# Altium schematic sheet Motordrivers.SchDoc
size A4; Revision: 0; SheetNumber: 1; SheetTotal: 4
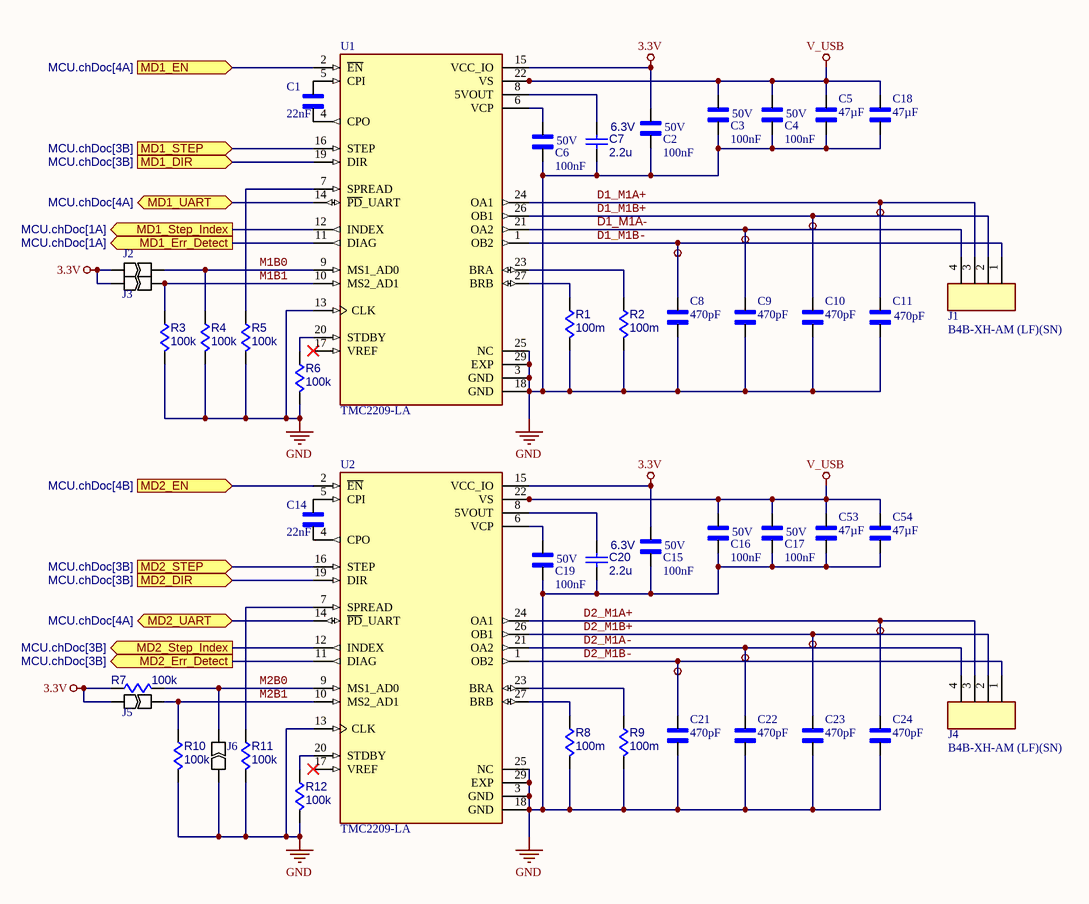
[diagram p0: Motordrivers.SchDoc]

## Parts
C1  value 22nF  [CAPC1005X55N]  (hidden comment: C0402C223K5REC7411)
C2  value 100nF  Voltage Rating: 50V  [CAPC1608X90N]  (hidden comment: GCM188L81H104KA57D)
C3  value 100nF  Voltage Rating: 50V  [CAPC1608X90N]  (hidden comment: GCM188L81H104KA57D)
C4  value 100nF  Voltage Rating: 50V  [CAPC1608X90N]  (hidden comment: GCM188L81H104KA57D)
C5  value 47µF  [CAPC3225X270N]  (hidden comment: GRM32ER61C476KE15L)
C6  value 100nF  Voltage Rating: 50V  [CAPC1608X90N]  (hidden comment: GCM188L81H104KA57D)
C7  value 2.2u  Voltage Rating: 6.3V  [CAPC0603(1608)100_L]  (hidden comment: Capacitors,2.2u,6.3V)
C8  value 470pF  [CAPC1608X90N]  (hidden comment: GRM1885C2A471JA01D)
C9  value 470pF  [CAPC1608X90N]  (hidden comment: GRM1885C2A471JA01D)
C10  value 470pF  [CAPC1608X90N]  (hidden comment: GRM1885C2A471JA01D)
C11  value 470pF  [CAPC1608X90N]  (hidden comment: GRM1885C2A471JA01D)
C14  value 22nF  [CAPC1005X55N]  (hidden comment: C0402C223K5REC7411)
C15  value 100nF  Voltage Rating: 50V  [CAPC1608X90N]  (hidden comment: GCM188L81H104KA57D)
C16  value 100nF  Voltage Rating: 50V  [CAPC1608X90N]  (hidden comment: GCM188L81H104KA57D)
C17  value 100nF  Voltage Rating: 50V  [CAPC1608X90N]  (hidden comment: GCM188L81H104KA57D)
C18  value 47µF  [CAPC3225X270N]  (hidden comment: GRM32ER61C476KE15L)
C19  value 100nF  Voltage Rating: 50V  [CAPC1608X90N]  (hidden comment: GCM188L81H104KA57D)
C20  value 2.2u  Voltage Rating: 6.3V  [CAPC0603(1608)100_L]  (hidden comment: Capacitors,2.2u,6.3V)
C21  value 470pF  [CAPC1608X90N]  (hidden comment: GRM1885C2A471JA01D)
C22  value 470pF  [CAPC1608X90N]  (hidden comment: GRM1885C2A471JA01D)
C23  value 470pF  [CAPC1608X90N]  (hidden comment: GRM1885C2A471JA01D)
C24  value 470pF  [CAPC1608X90N]  (hidden comment: GRM1885C2A471JA01D)
C53  value 47µF  [CAPC3225X270N]  (hidden comment: GRM32ER61C476KE15L)
C54  value 47µF  [CAPC3225X270N]  (hidden comment: GRM32ER61C476KE15L)
J1  B4B-XH-AM (LF)(SN)  [FP-B4B-XH-AM_LF_SN-MFG]
J2  JUMPER  [JUMPER]  (value not drawn)
J3  JUMPER  [JUMPER]  (value not drawn)
J4  B4B-XH-AM (LF)(SN)  [FP-B4B-XH-AM_LF_SN-MFG]
J5  JUMPER  [JUMPER]  (value not drawn)
J6  JUMPER  [JUMPER]  (value not drawn)
R1  value 100m  [RESC0402(1005)_L]  (hidden comment: Resistors,0402,1%,100m)
R2  value 100m  [RESC0402(1005)_L]  (hidden comment: Resistors,0402,1%,100m)
R3  value 100k  [RESC0402(1005)_L]  (hidden comment: Resistors,0402,100k)
R4  value 100k  [RESC0402(1005)_L]  (hidden comment: Resistors,0402,100k)
R5  value 100k  [RESC0402(1005)_L]  (hidden comment: Resistors,0402,100k)
R6  value 100k  [RESC0402(1005)_L]  (hidden comment: Resistors,0402,100k)
R7  value 100k  [RESC0402(1005)_L]  (hidden comment: Resistors,0402,100k)
R8  value 100m  [RESC0402(1005)_L]  (hidden comment: Resistors,0402,1%,100m)
R9  value 100m  [RESC0402(1005)_L]  (hidden comment: Resistors,0402,1%,100m)
R10  value 100k  [RESC0402(1005)_L]  (hidden comment: Resistors,0402,100k)
R11  value 100k  [RESC0402(1005)_L]  (hidden comment: Resistors,0402,100k)
R12  value 100k  [RESC0402(1005)_L]  (hidden comment: Resistors,0402,100k)
U1  TMC2209-LA  [QFN50P500X500X90-29N]
U2  TMC2209-LA  [QFN50P500X500X90-29N]

## Ports
MD1_DIR (in, see MCU.chDoc[3B]), MD1_EN (in, see MCU.chDoc[4A]), MD1_Err_Detect (out, see MCU.chDoc[1A]), MD1_STEP (in, see MCU.chDoc[3B]), MD1_Step_Index (out, see MCU.chDoc[1A]), MD1_UART (bidir, see MCU.chDoc[4A]), MD2_DIR (in, see MCU.chDoc[3B]), MD2_EN (in, see MCU.chDoc[4B]), MD2_Err_Detect (out, see MCU.chDoc[3B]), MD2_STEP (in, see MCU.chDoc[3B]), MD2_Step_Index (out, see MCU.chDoc[3B]), MD2_UART (bidir, see MCU.chDoc[4A])

## Nets
3.3V: C2.1 C15.1 J2.1 J3.1 J5.1 R7.1 U1.15(VCC_IO) U2.15(VCC_IO)
D1_M1A+: C11.2 J1.3 U1.24(OA1)
D1_M1A-: C9.2 J1.4 U1.21(OA2)
D1_M1B+: C10.2 J1.2 U1.26(OB1)
D1_M1B-: C8.2 J1.1 U1.1(OB2)
D2_M1A+: C24.2 J4.3 U2.24(OA1)
D2_M1A-: C22.2 J4.4 U2.21(OA2)
D2_M1B+: C23.2 J4.2 U2.26(OB1)
D2_M1B-: C21.2 J4.1 U2.1(OB2)
GND: C2.2 C3.2 C4.2 C5.2 C6.2 C7.2 C8.1 C9.1 C10.1 C11.1 C15.2 C16.2 C17.2 C18.2 C19.2 C20.2 C21.1 C22.1 C23.1 C24.1 C53.2 C54.2 J6.1 R1.2 R2.2 R3.2 R4.2 R5.2 R6.2 R8.2 R9.2 R10.2 R11.2 R12.2 U1.3(GND) U1.13(CLK) U1.18(GND) U1.25(NC) U1.29(EXP) U2.3(GND) U2.13(CLK) U2.18(GND) U2.25(NC) U2.29(EXP)
V_USB: C3.1 C4.1 C5.1 C16.1 C17.1 C18.1 C53.1 C54.1 U1.22(VS) U1.28(VS) U2.22(VS) U2.28(VS)
M1B0: J2.2 R4.1 U1.9(MS1_AD0)
M1B1: J3.2 R3.1 U1.10(MS2_AD1)
M2B0: J6.2 R7.2 U2.9(MS1_AD0)
M2B1: J5.2 R10.1 U2.10(MS2_AD1)
MD1_DIR: U1.19(DIR) ; port MD1_DIR
MD1_EN: U1.2(~{EN}) ; port MD1_EN
MD1_Err_Detect: U1.11(DIAG) ; port MD1_Err_Detect
MD1_STEP: U1.16(STEP) ; port MD1_STEP
MD1_Step_Index: U1.12(INDEX) ; port MD1_Step_Index
MD1_UART: U1.14(~{PD}_UART) ; port MD1_UART
MD2_DIR: U2.19(DIR) ; port MD2_DIR
MD2_EN: U2.2(~{EN}) ; port MD2_EN
MD2_Err_Detect: U2.11(DIAG) ; port MD2_Err_Detect
MD2_STEP: U2.16(STEP) ; port MD2_STEP
MD2_Step_Index: U2.12(INDEX) ; port MD2_Step_Index
MD2_UART: U2.14(~{PD}_UART) ; port MD2_UART
NetC1_1: C1.1 U1.4(CPO)
NetC1_2: C1.2 U1.5(CPI)
NetC6_1: C6.1 U1.6(VCP)
NetC7_1: C7.1 U1.8(5VOUT)
NetC14_1: C14.1 U2.4(CPO)
NetC14_2: C14.2 U2.5(CPI)
NetC19_1: C19.1 U2.6(VCP)
NetC20_1: C20.1 U2.8(5VOUT)
NetR1_1: R1.1 U1.27(BRB)
NetR2_1: R2.1 U1.23(BRA)
NetR5_1: R5.1 U1.7(SPREAD)
NetR6_1: R6.1 U1.20(STDBY)
NetR8_1: R8.1 U2.27(BRB)
NetR9_1: R9.1 U2.23(BRA)
NetR11_1: R11.1 U2.7(SPREAD)
NetR12_1: R12.1 U2.20(STDBY)

Not connected (* = marked no-connect by the designer): U1 17(VREF)*; U2 17(VREF)*

## Notes on the sheet
- Title
- Engineer
- Size:
- Date:
- A4
- Number:
- Time:
- Revision:
- Sheet
- of
- File:

## Library data of the parts
C1 C14 = CMP-001-00084-1: 0.022 ÂµF Â±10% 50V Ceramic Capacitor X7R 0402 (1005 Metric); MF: KEMET; Case/Package: 1005 KEMET; Pins: 2; Component Type: Standard; Source: C0402C223K5REC7411.SchLib; SnapEDA_Link: https://www.snapeda.com/parts/C0402C223K5REC7411/KEMET/view-part/?ref=snap; MP: C0402C223K5REC7411; Design Item ID: C0402C223K5REC7411; Check_prices: https://www.snapeda.com/parts/C0402C223K5REC7411/KEMET/view-part/?ref=eda
C2-C4 C6 C15-C17 C19 = CMP-001-00085-1: SMD capacitor X8L(MURATA) with capacitance 0.10uF Tol.10%. Rated voltage 50Vdc 150C; MF: Murata Electronics; Pins: 2; Component Type: Standard; Check_prices: https://www.snapeda.com/parts/GCM188L81H104KA57D/Murata+Electronics+North+America/view-part/?ref=eda; Source: GCM188L81H104KA57D.SchLib; MP: GCM188L81H104KA57D; Design Item ID: GCM188L81H104KA57D; SnapEDA_Link: https://www.snapeda.com/parts/GCM188L81H104KA57D/Murata+Electronics+North+America/view-part/?ref=snap
C5 C18 C53 C54 = CMP-001-00087-1: SMD Capacitor X5R(EIA) with Capacitance: 47uF Tol. 10%. Rated Voltage: 16Vdc; MF: Murata Electronics; Case/Package: 3225 Murata; Pins: 2; Component Type: Standard; Source: GRM32ER61C476KE15L.SchLib; SnapEDA_Link: https://www.snapeda.com/parts/GRM32ER61C476KE15L/Murata+Electronics+North+America/view-part/?ref=snap; Design Item ID: GRM32ER61C476KE15L; MP: GRM32ER61C476KE15L; Check_prices: https://www.snapeda.com/parts/GRM32ER61C476KE15L/Murata+Electronics+North+America/view-part/?ref=eda
C7 C20 = Capacitors: Capacitor, Decoupling; Component Type: Capacitors
C8-C11 C21-C24 = CMP-001-00083-1: SMD Capacitor C0G(EIA) with Capacitance: 470pF Tol. 5%. Rated Voltage: 100Vdc; MF: Murata Electronics; Case/Package: 1608 Murata; Pins: 2; Component Type: Standard; Source: GRM1885C2A471JA01D.SchLib; MP: GRM1885C2A471JA01D; SnapEDA_Link: https://www.snapeda.com/parts/GRM1885C2A471JA01D/Murata+Electronics+North+America/view-part/?ref=snap; Check_prices: https://www.snapeda.com/parts/GRM1885C2A471JA01D/Murata+Electronics+North+America/view-part/?ref=eda; Design Item ID: GRM1885C2A471JA01D
J1 J4 = CMP-002-00073-1: CONN HEADER VERT 4POS 2.5MM / Connector Header Through Hole 4 position 0.098" (2.50mm); Number of Positions: 4; Connector Type: Male Pin; Pitch: 2.4892mm; Insulation Resistance: 1GΩ; Contact Resistance: 20mΩ; Ratings: TUV; Current Rating: 3A; Gender: Male; Voltage Rating: 250V; Termination: Solder; Orientation: Straight; Mounting Technology: Through Hole; Min Operating Temperature: -25°C; Terminal Pitch: 2.5mm; Housing Material: Polyamide; Max Operating Temperature: 85°C; Depth: 5.75mm; Lead Free: Lead Free; Length: 12.4mm; Harmonized Tariff Schedule (HTS) Code: 8536.69.40.40; Housing Color: White; RoHS: Compliant; Fastening Type: Detent; Color: Green; Introduction Date: 2010-11-30; Packaging: Box; Contact Material: Brass; Number of Contacts: 4; Export Control Classification Number (ECCN) Code: EAR99; Height: 7mm; Contact Plating: Tin; Insulation Color: White; Max Current Rating: 3A; Lifecycle Status: Production; Pins: 4; Max Voltage Rating (AC): 250V; Number of Rows: 1; REACH SVHC: Yes
J2 J3 J5 J6 = CMP-009-00061-10: Pins: 2
R1 R2 R8 R9 = Resistors: Resistor; Case/Package: 0402; Tolerance: 1%; Component Type: Resistors
R3-R7 R10-R12 = Resistors: Resistor, Bootstrap; Case/Package: 0402; Component Type: Resistors
U1 U2 = CMP-010-000001-7: Bipolar Motor Driver Power MOSFET Step/Direction, UART 28-QFN (5x5); MF: Maxim Integrated Products; MP: TMC2209-LA; Design Item ID: TMC2209-LA; Value: *; Pin Count: 29; Component Type: Standard; SnapEDA_Link: https://www.snapeda.com/parts/TMC2209-LA/Maxim+Integrated/view-part/?ref=snap; Package: None; Check_prices: https://www.snapeda.com/parts/TMC2209-LA/Maxim+Integrated/view-part/?ref=eda; Source: TMC2209-LA.SchLib